# Altium schematic sheet WL-ADC.SchDoc: WOLF
size 420 x 297 mm; DocumentNumber: ТРАНСИВЕР «ВОЛК»; SheetNumber: 4; SheetTotal: 4; Time: WOLF
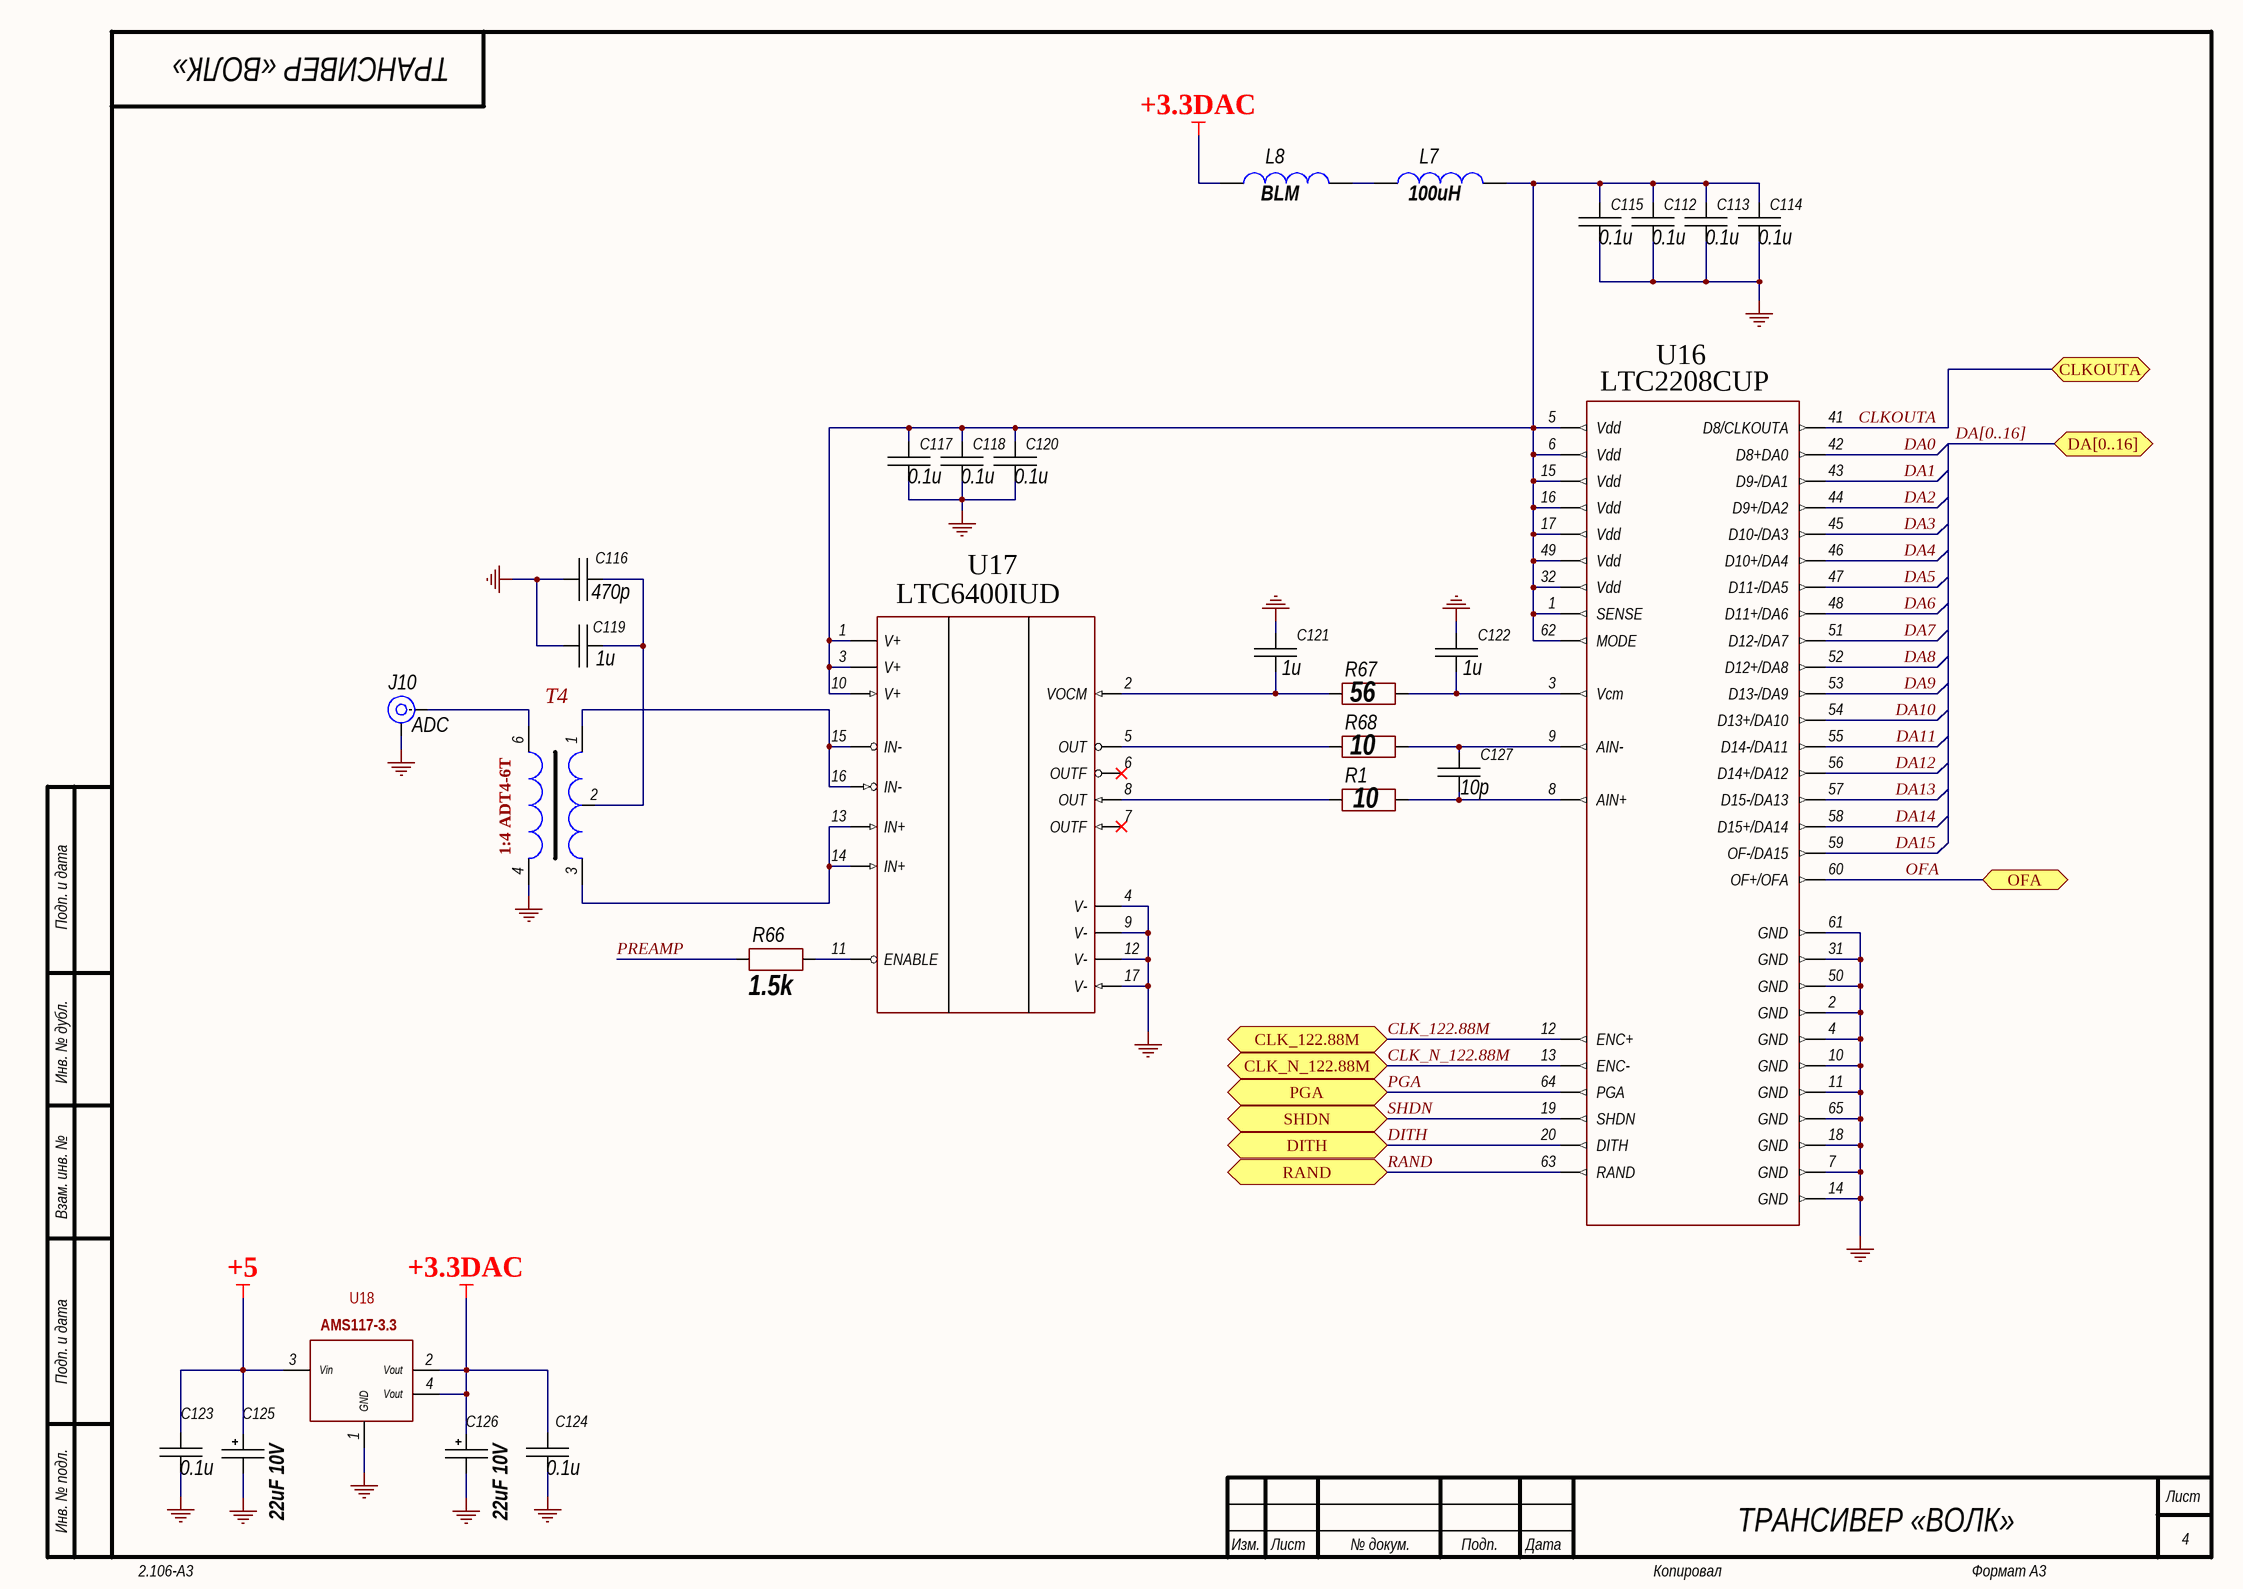
[diagram p0: WL-ADC.SchDoc]

## Parts
C112  0.1u  [CH0805C]
C113  0.1u  [CH0805C]
C114  0.1u  [CH0805C]
C115  0.1u  [CH0805C]
C116  470p  [CH0805C]
C117  0.1u  [CH0805C]
C118  0.1u  [CH0805C]
C119  1u  [CH0805C]
C120  0.1u  [CH0805C]
C121  1u  [CH0805C]
C122  1u  [CH0805C]
C123  0.1u  [CH0805C]
C124  0.1u  [CH0805C]
C125  22uF 10V  [TANTAL_B]
C126  22uF 10V  [TANTAL_B]
C127  10p  [CH0805C]
J10  ADC  [CON: SMA]
L7  100uH  [L1210]
L8  BLM  [CH0805L]
R1  10  [CH0805R]
R66  1.5k  [CH0805R]
R67  56  [CH0805R]
R68  10  [CH0805R]
T4  1:4 ADT4-6T  [TC1-4]
U16  LTC2208CUP  [64-QFN (9x9)]
U17  LTC6400IUD  [16-QFN 3x3]
U18  AMS117-3.3  [SOT223]

## Ports
CLK_122.88M (bidir), CLK_N_122.88M (bidir), CLKOUTA (bidir), DA[0..16] (bidir), DITH (bidir), OFA (bidir), PGA (bidir), RAND (bidir), SHDN (bidir)

## Nets
+3.3DAC: C124.2 C126.1 L8.2 U18.2(Vout) U18.4(Vout)
+5: C123.2 C125.1 U18.3(Vin)
GND: C112.1 C113.1 C114.1 C115.1 C116.2 C117.1 C118.1 C119.2 C120.1 C121.2 C122.2 C123.1 C124.1 C125.2 C126.2 J10.2(IN) T4.4 U16.2(GND) U16.4(GND) U16.7(GND) U16.10(GND) U16.11(GND) U16.14(GND) U16.18(GND) U16.31(GND) U16.50(GND) U16.61(GND) U16.65(GND) U17.4(V-) U17.9(V-) U17.12(V-) U17.17(V-) U18.1(GND)
CLK_122.88M: U16.12(ENC+) ; port CLK_122.88M
CLK_N_122.88M: U16.13(ENC-) ; port CLK_N_122.88M
CLKOUTA: U16.41(D8/CLKOUTA) ; port CLKOUTA
DA0: U16.42(D8+DA0)
DA1: U16.43(D9-/DA1)
DA2: U16.44(D9+/DA2)
DA3: U16.45(D10-/DA3)
DA4: U16.46(D10+/DA4)
DA5: U16.47(D11-/DA5)
DA6: U16.48(D11+/DA6)
DA7: U16.51(D12-/DA7)
DA8: U16.52(D12+/DA8)
DA9: U16.53(D13-/DA9)
DA10: U16.54(D13+/DA10)
DA11: U16.55(D14-/DA11)
DA12: U16.56(D14+/DA12)
DA13: U16.57(D15-/DA13)
DA14: U16.58(D15+/DA14)
DA15: U16.59(OF-/DA15)
DITH: U16.20(DITH) ; port DITH
OFA: U16.60(OF+/OFA) ; port OFA
PGA: U16.64(PGA) ; port PGA
PREAMP: R66.2
RAND: U16.63(RAND) ; port RAND
SHDN: U16.19(SHDN) ; port SHDN
NetC112_2: C112.2 C113.2 C114.2 C115.2 C117.2 C118.2 C120.2 L7.1 U16.1(SENSE) U16.5(Vdd) U16.6(Vdd) U16.15(Vdd) U16.16(Vdd) U16.17(Vdd) U16.32(Vdd) U16.49(Vdd) U16.62(MODE) U17.1(V+) U17.3(V+) U17.10(V+)
NetC116_1: C116.1 C119.1 T4.2
NetC121_1: C121.1 R67.2 U17.2(VOCM)
NetC122_1: C122.1 R67.1 U16.3(Vcm)
NetC127_1: C127.1 R1.1 U16.8(AIN+)
NetC127_2: C127.2 R68.1 U16.9(AIN-)
NetJ10_1: J10.1(IN) T4.6
NetL7_2: L7.2 L8.1
NetR1_2: R1.2 U17.8(OUT)
NetR66_1: R66.1 U17.11(ENABLE)
NetR68_2: R68.2 U17.5(OUT)
NetT4_1: T4.1 U17.15(IN-) U17.16(IN-)
NetT4_3: T4.3 U17.13(IN+) U17.14(IN+)

Not connected (* = marked no-connect by the designer): U17 6(OUTF)* 7(OUTF)*

## Buses and harness runs
bus DA[0..16] = port DA[0..16]

## Notes on the sheet
- Подп. и дата
- Инв. № дубл.
- Взам. инв. №
- Инв. № подл.
- Изм.
- Лист
- № докум.
- Подп.
- Дата
- 2.106-A3
- Копировал
- Формат А3

## Library data of the parts
C112-C124 C127 = Capacitor: Manufacturer: *; Model: *; HelpURL: *; ComponentKind: *; Value: *
C125 C126 = TantalCap: Manufacturer: *; Model: *; HelpURL: *; ComponentKind: *; Value: *
J10 = SMA: RF; Model: *; Manufacturer: *; HelpURL: *; ComponentKind: *
L7 L8 = Inductor: Manufacturer: *; Model: *; HelpURL: *; ComponentKind: *; Value: *
R1 R66-R68 = Resistor: Manufacturer: *; Model: *; HelpURL: *; ComponentKind: *; Value: *
T4 = TC4-1
U18 = AMS117